# Altium schematic sheet MICROCONTROLLER.SchDoc
size A4; SheetNumber: 4; SheetTotal: 6
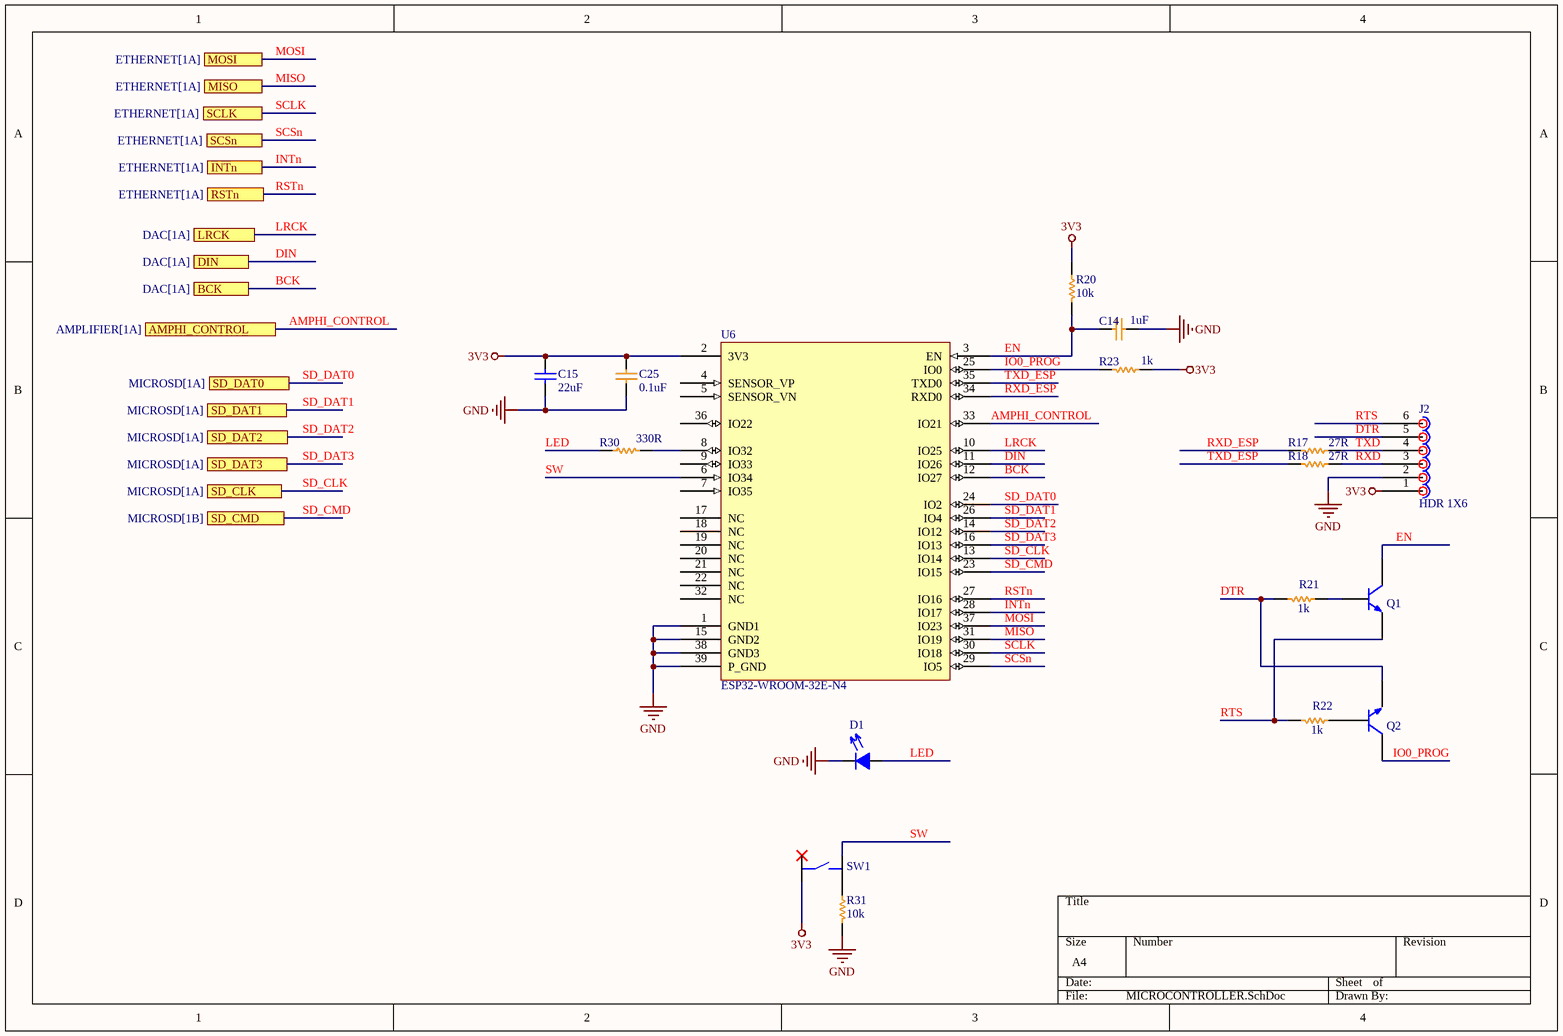
[diagram p0: MICROCONTROLLER.SchDoc]

## Parts
C14  1uF  [CAP-0603]
C15  22uF  [CAP-0805]
C25  0.1uF  [CAP-0603]
D1  LTST-C170GKT  [LED-0805]  (value not drawn)
J2  HDR 1X6  [HDR 1X6]
Q1  S8050  [SOT-23]  (value not drawn)
Q2  S8050  [SOT-23]  (value not drawn)
R17  27R  [RES-0603]
R18  27R  [RES-0603]
R20  10k  [RES-0603]
R21  1k  [RES-0603]
R22  1k  [RES-0603]
R23  1k  [RES-0603]
R30  330R  [RES-0603]
R31  10k  [RES-0603]
SW1  PTS645SK43SMTR92 LFS  [SW-SMD-6x6]  (value not drawn)
U6  ESP32-WROOM-32E-N4  [ESP32-WROOM-32E-N4]

## Ports
AMPHI_CONTROL (see AMPLIFIER[1A]), BCK (see DAC[1A]), DIN (see DAC[1A]), INTn (see ETHERNET[1A]), LRCK (see DAC[1A]), MISO (see ETHERNET[1A]), MOSI (see ETHERNET[1A]), RSTn (see ETHERNET[1A]), SCLK (see ETHERNET[1A]), SCSn (see ETHERNET[1A]), SD_CLK (see MICROSD[1A]), SD_CMD (see MICROSD[1B]), SD_DAT0 (see MICROSD[1A]), SD_DAT1 (see MICROSD[1A]), SD_DAT2 (see MICROSD[1A]), SD_DAT3 (see MICROSD[1A])

## Nets
3V3: C15.2 C25.2 J2.1 R20.2 R23.2 SW1.4 U6.2(3V3)
GND: C14.1 C15.1 C25.1 D1.2 J2.2 R31.1 U6.1(GND1) U6.15(GND2) U6.38(GND3) U6.39(P_GND)
AMPHI_CONTROL: U6.33(IO21) ; port AMPHI_CONTROL
BCK: U6.12(IO27) ; port BCK
DIN: U6.11(IO26) ; port DIN
DTR: J2.5 Q2.2 R21.1
EN: C14.2 Q1.3 R20.1 U6.3(EN)
INTn: U6.28(IO17) ; port INTn
IO0_PROG: Q2.3 R23.1 U6.25(IO0)
LED: D1.1 R30.2
LRCK: U6.10(IO25) ; port LRCK
MISO: U6.31(IO19) ; port MISO
MOSI: U6.37(IO23) ; port MOSI
RSTn: U6.27(IO16) ; port RSTn
RTS: J2.6 Q1.2 R22.1
RXD: J2.3 R18.2
RXD_ESP: R17.1 U6.34(RXD0)
SCLK: U6.30(IO18) ; port SCLK
SCSn: U6.29(IO5) ; port SCSn
SD_CLK: U6.13(IO14) ; port SD_CLK
SD_CMD: U6.23(IO15) ; port SD_CMD
SD_DAT0: U6.24(IO2) ; port SD_DAT0
SD_DAT1: U6.26(IO4) ; port SD_DAT1
SD_DAT2: U6.14(IO12) ; port SD_DAT2
SD_DAT3: U6.16(IO13) ; port SD_DAT3
SW: SW1.1 U6.6(IO34)
TXD: J2.4 R17.2
TXD_ESP: R18.1 U6.35(TXD0)
NetQ1_1: Q1.1 R21.2
NetQ2_1: Q2.1 R22.2
NetR30_1: R30.1 U6.8(IO32)
NetR31_2: R31.2 SW1.2

Not connected (* = marked no-connect by the designer): SW1 3*; U6 4(SENSOR_VP) 5(SENSOR_VN) 7(IO35) 9(IO33) 17(NC) 18(NC) 19(NC) 20(NC) 21(NC) 22(NC) 32(NC) 36(IO22)

## Library data of the parts
C14 = CAP-0603: CAP CER 1UF 10V X7R 0603
C15 = CAP-0805: CAP CER 22UF 10V X5R 0805
C25 = CAP-0603: CAP CER 0.1UF 10V X7R 0603
D1 = LTST-C170GKT: LED GREEN CLEAR SMD
Q1 Q2 = S8050: TRANS NPN 25V 0.5A SOT-23
R17 R18 = RES-0603: RES SMD 27 OHM 1% 1/10W 0603
R20 R31 = RES-0603: RES SMD 10K OHM 1% 1/10W 0603
R21-R23 = RES-0603: RES SMD 1K OHM 1% 1/10W 0603
R30 = RES-0603: RES SMD 330 OHM 5% 1/10W 0603
SW1 = PTS645SK43SMTR92 LFS: G TYPE SMT SWITCH TACTILE SPST-NO 0.05A 12V
U6 = ESP32-WROOM-32E-N4: RF TXRX MOD BT WIFI TH SMD